# Altium schematic sheet Daylight_Sensor_Network.SchDoc
size A
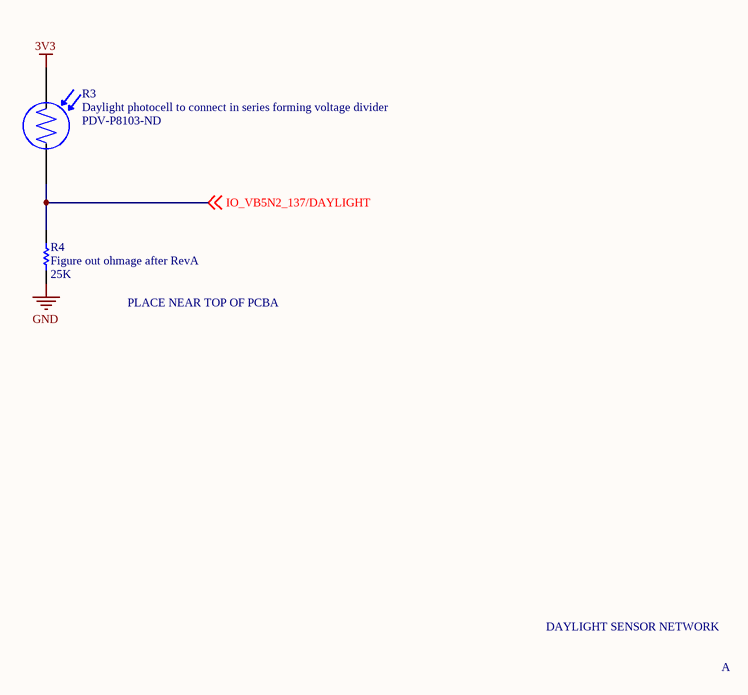
[diagram p0: Daylight_Sensor_Network.SchDoc]

## Parts
R3  Daylight photocell to connect in series forming voltage divider  Supplier Part Number 1: PDV-P8103-ND  [RES_NSL-19M51]
R4  Figure out ohmage after RevA  value 25K  [RES_0603]

## Nets
3V3: R3.1
GND: R4.1
IO_VB5N2_137/DAYLIGHT: R3.2 R4.2 ; off-sheet IO_VB5N2_137/DAYLIGHT

## Notes on the sheet
- PLACE NEAR TOP OF PCBA
- DAYLIGHT SENSOR NETWORK
- A

## Library data of the parts
R3 = PHOTOCELL 16-33KOHM: http://media.digikey.com/pdf/Data%20Sheets/Photonic%20Detetectors%20Inc%20PDFs/PDV-P8103.pdf; Supplier 1: Digi-Key
R4 = Res1: Resistor; Published: 8-Jun-2000; LatestRevisionDate: 17-Jul-2002; LatestRevisionNote: Re-released for DXP Platform.; PackageReference: AXIAL-0.3; Publisher: Altium Limited; PackageDescription: Axial Device, Thru-Hole; 2 Leads; 0.3 in Pin Spacing